# Altium schematic sheet Steering Motor Driver.SchDoc
size A4
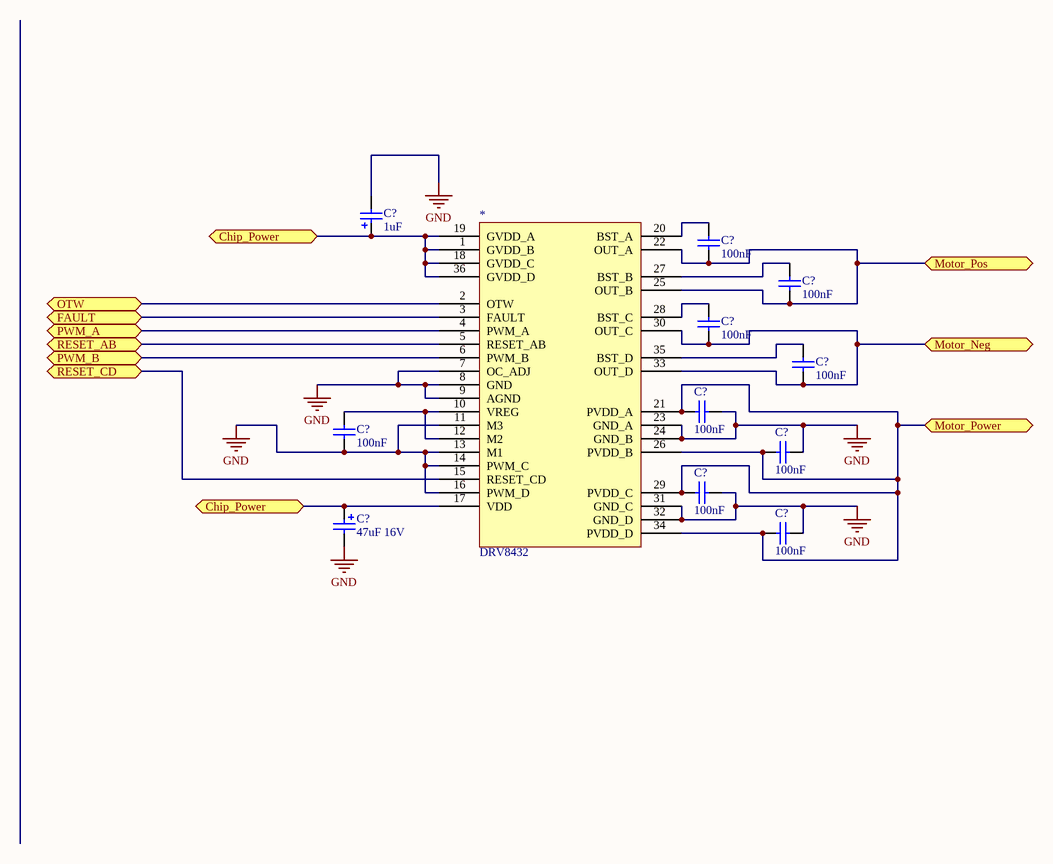
[diagram p0: Steering Motor Driver.SchDoc]

## Parts
(Parts that share a designator on the sheet are numbered #1, #2 ... from top to bottom, then left to right.)
*  DRV8432
C?#1  1uF  [RB0.1-0.2]
C?#2  100nF  [CC0805]
C?#3  100nF  [CC0805]
C?#4  100nF  [CC0805]
C?#5  100nF  [CC0805]
C?#6  100nF  [CC0805]
C?#7  100nF  [CC0805]
C?#8  100nF  [CC0805]
C?#9  100nF  [CC0805]
C?#10  47uF 16V  [TANT7343]
C?#11  100nF  [CC0805]

## Ports
Chip_Power, FAULT, Motor_Neg, Motor_Pos, Motor_Power, OTW, PWM_A, PWM_B, RESET_AB, RESET_CD

## Nets
GND: *.7(OC_ADJ) *.8(GND) *.9(AGND) *.11(M3) *.13(M1) *.14(PWM_C) *.16(PWM_D) *.23(GND_A) *.24(GND_B) *.31(GND_C) *.32(GND_D) C?#1.2 C?#6.1 C?#7.1 C?#8.1 C?#9.1 C?#10.2 C?#11.1
Chip_Power: *.1(GVDD_B) *.17(VDD) *.18(GVDD_C) *.19(GVDD_A) *.36(GVDD_D) C?#1.1 C?#10.1 ; port Chip_Power
FAULT: *.3(FAULT) ; port FAULT
Motor_Neg: *.30(OUT_C) *.33(OUT_D) C?#4.1 C?#5.1 ; port Motor_Neg
Motor_Pos: *.22(OUT_A) *.25(OUT_B) C?#2.1 C?#3.1 ; port Motor_Pos
Motor_Power: *.21(PVDD_A) *.26(PVDD_B) *.29(PVDD_C) *.34(PVDD_D) C?#6.2 C?#8.2 C?#9.2 C?#11.2 ; port Motor_Power
OTW: *.2(OTW) ; port OTW
PWM_A: *.4(PWM_A) ; port PWM_A
PWM_B: *.6(PWM_B) ; port PWM_B
RESET_AB: *.5(RESET_AB) ; port RESET_AB
RESET_CD: *.15(RESET_CD) ; port RESET_CD
Net*_10: *.10(VREG) *.12(M2) C?#7.2
Net*_20: *.20(BST_A) C?#2.2
Net*_27: *.27(BST_B) C?#3.2
Net*_28: *.28(BST_C) C?#4.2
Net*_35: *.35(BST_D) C?#5.2

## Library data of the parts
C?#1 = 1uF_63V_RB0.1-0.2: 1uF 63V Electrolytic Cap; Supplier_Component_Code: RE-6032; published: 27/09/2006; Supplier_Name: Soanar Plus; price: 0.08; value: 1uF; Part Number: 1uF_63V_RB0.1-0.2; Component Kind: Standard; Component Type: Standard; Designator: 1uF_63V_RB0.1-0.2; Pin Count: 2
C?#2-C?#9 C?#11 = 100nF_CC0805: 0805 Capacitor; Supplier_Component_Code: RC-P133; published: 28/03/2007 10:54:57 a.m.; Supplier_Name: Soanar Plus; price: 0.1; value: 100nF; Part Number: 100nF_CC0805; Component Kind: Standard; Component Type: Standard; Designator: 100nF_CC0805; Pin Count: 2
C?#10 = TANT47uF_16V_7343: SM Tantalum Cap; Supplier_Component_Code: RZ-6574; published: 12/03/2007 11:34:36 a.m.; Supplier_Name: Soanar Plus; price: 1.9; value: 47uF 16V; Part Number: TANT47uF_16V_7343; Component Kind: Standard; Component Type: Standard; Designator: TANT47uF_16V_7343; Pin Count: 2